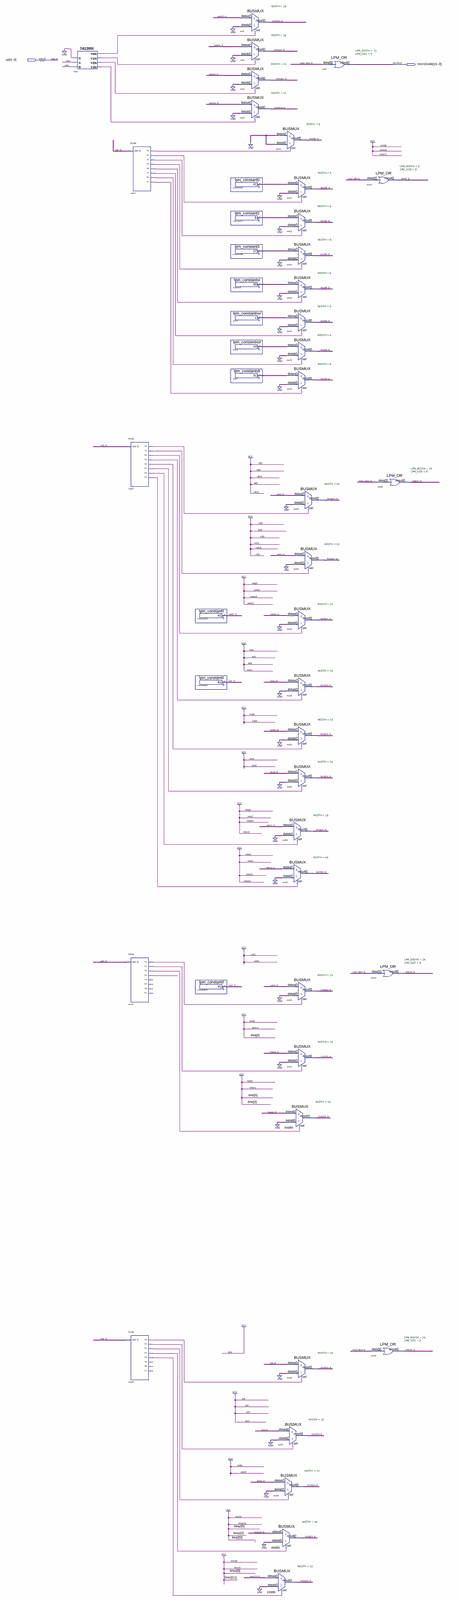
[diagram p0: schematic sheet, whole]
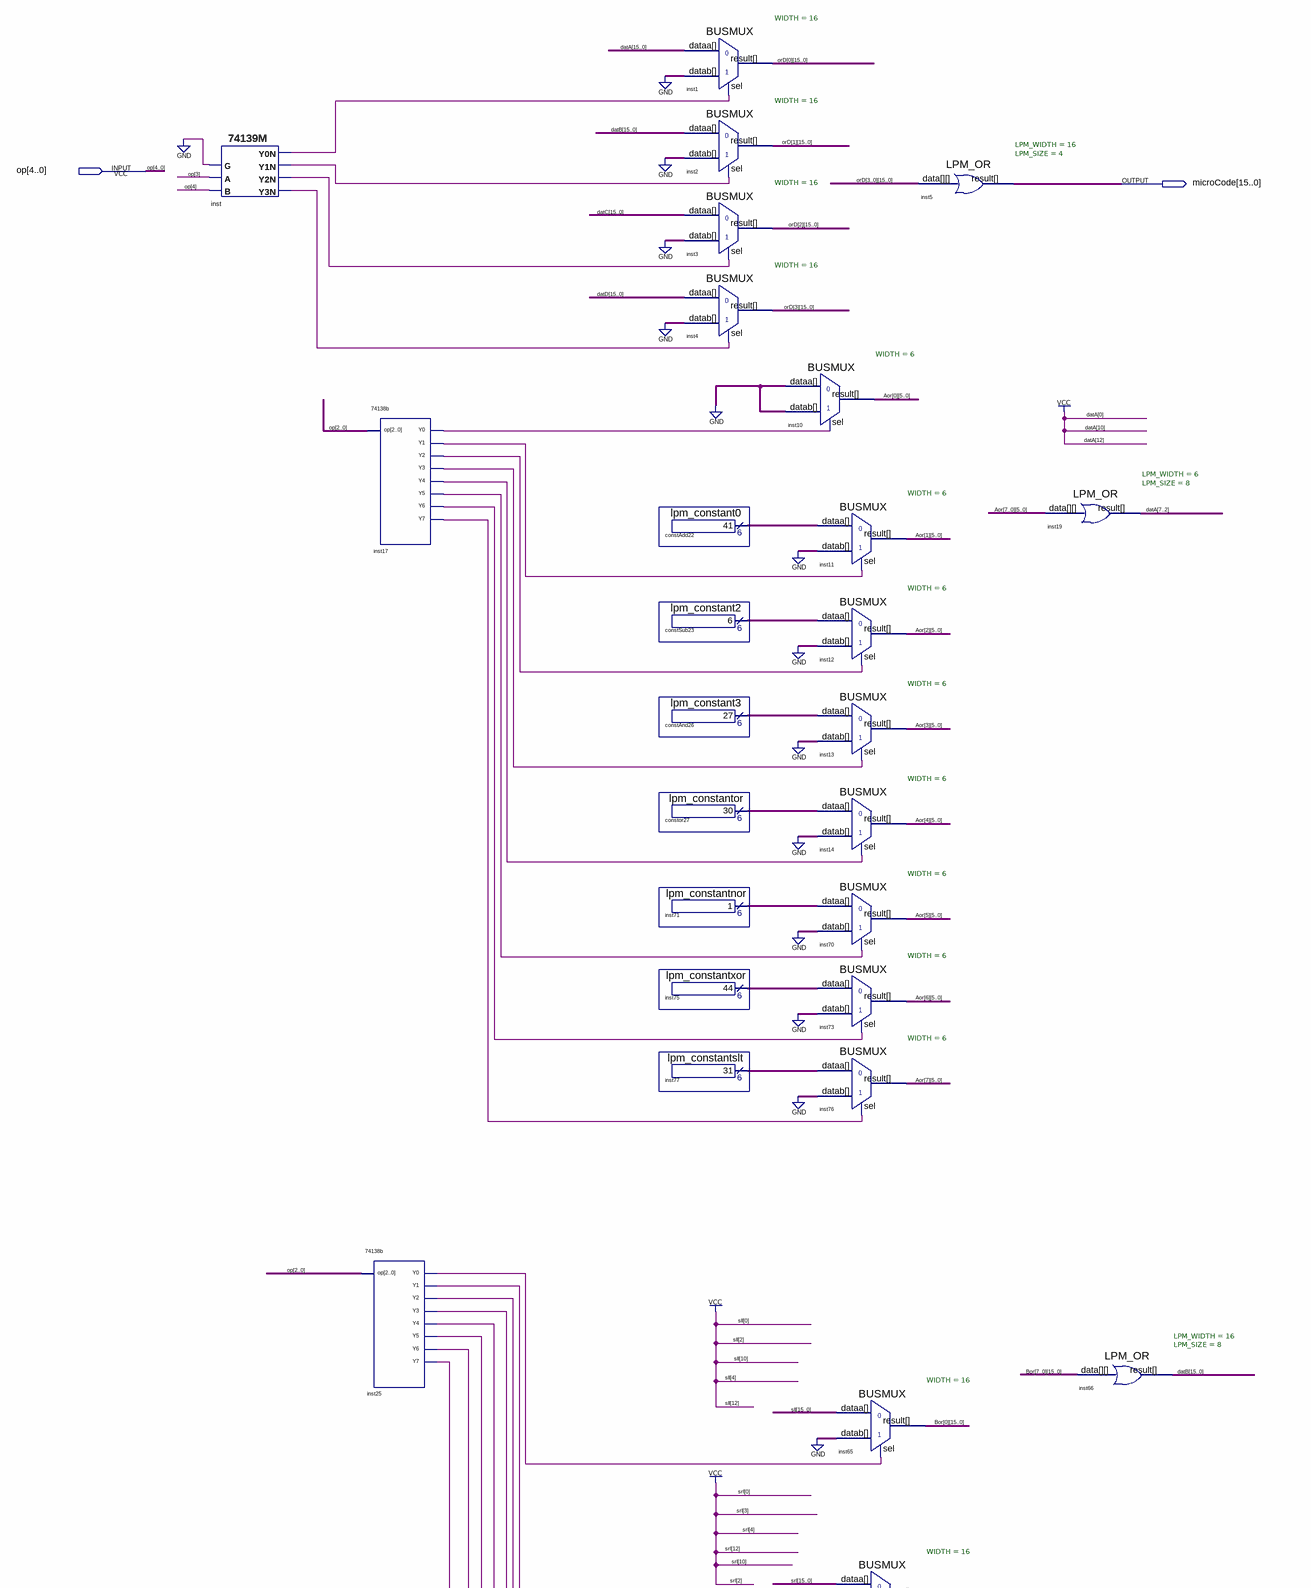
[diagram p1: schematic sheet, upper part]
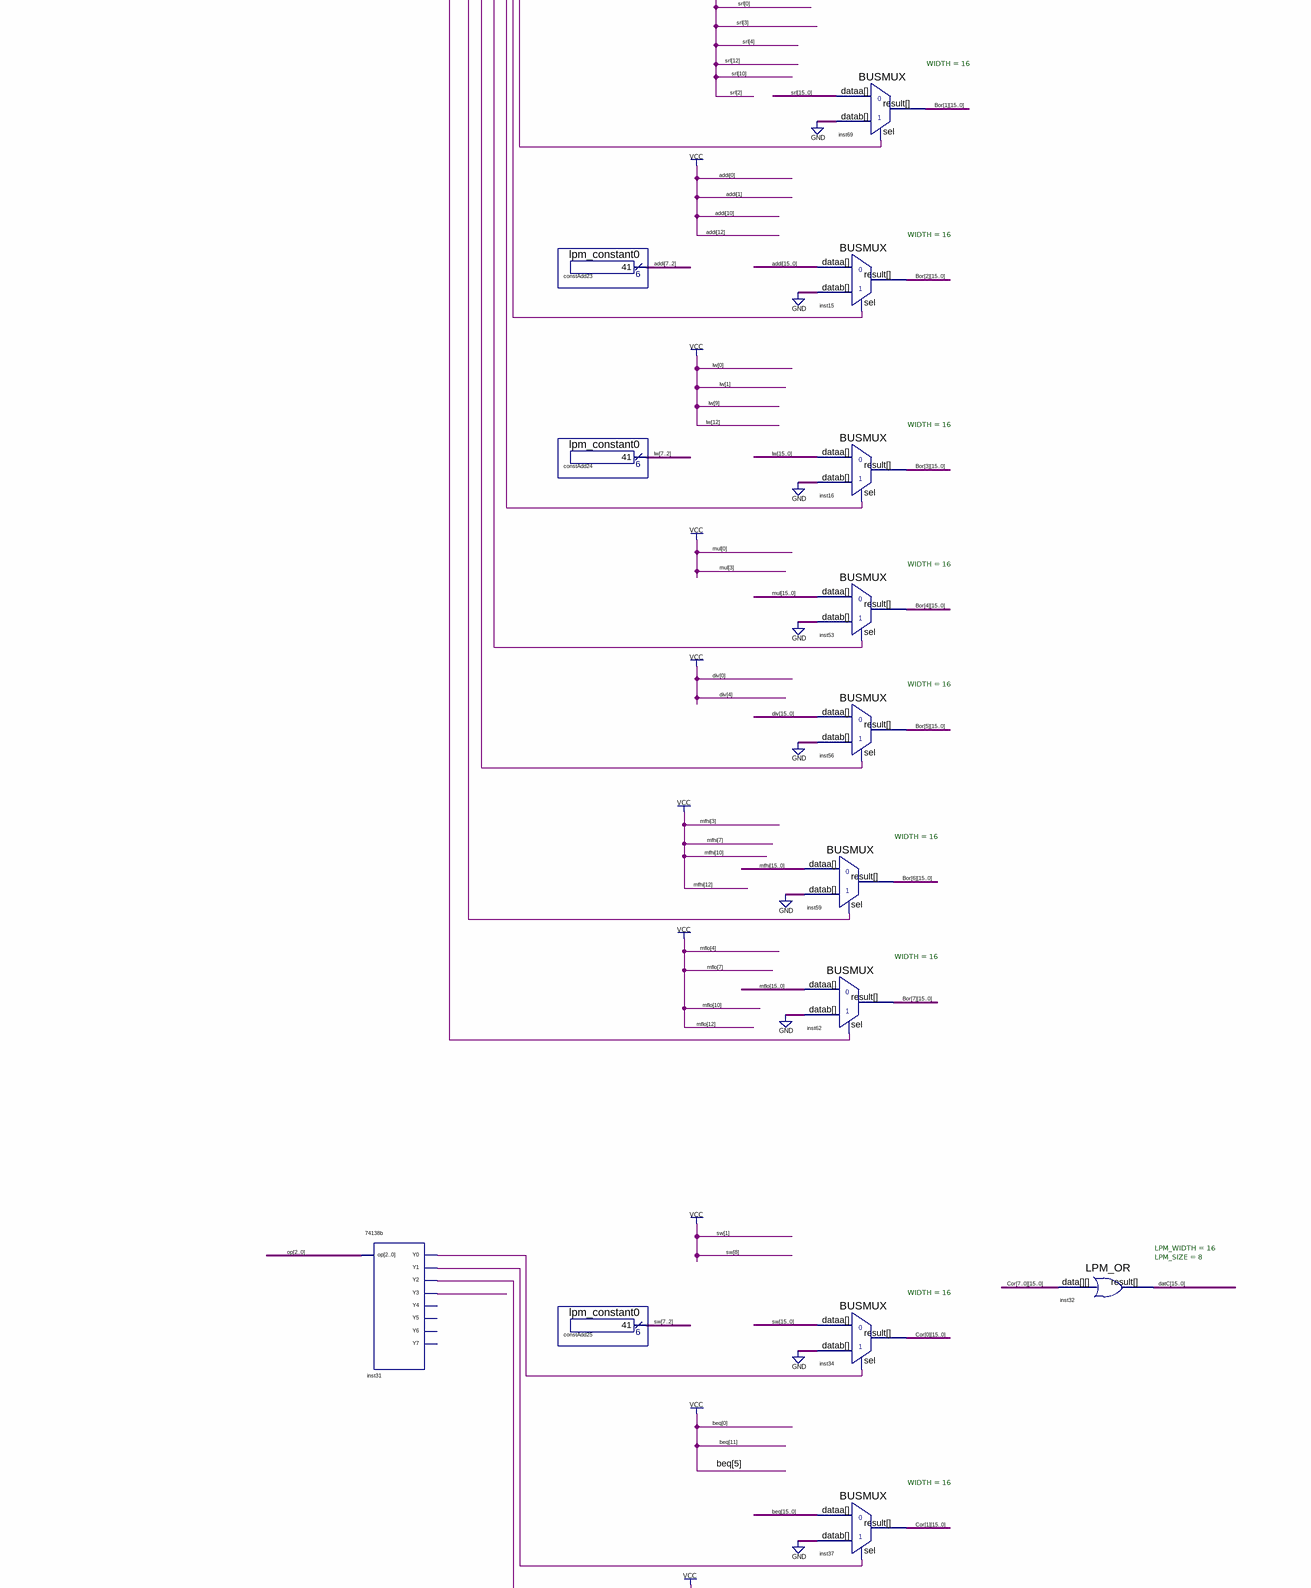
[diagram p2: schematic sheet, middle part]
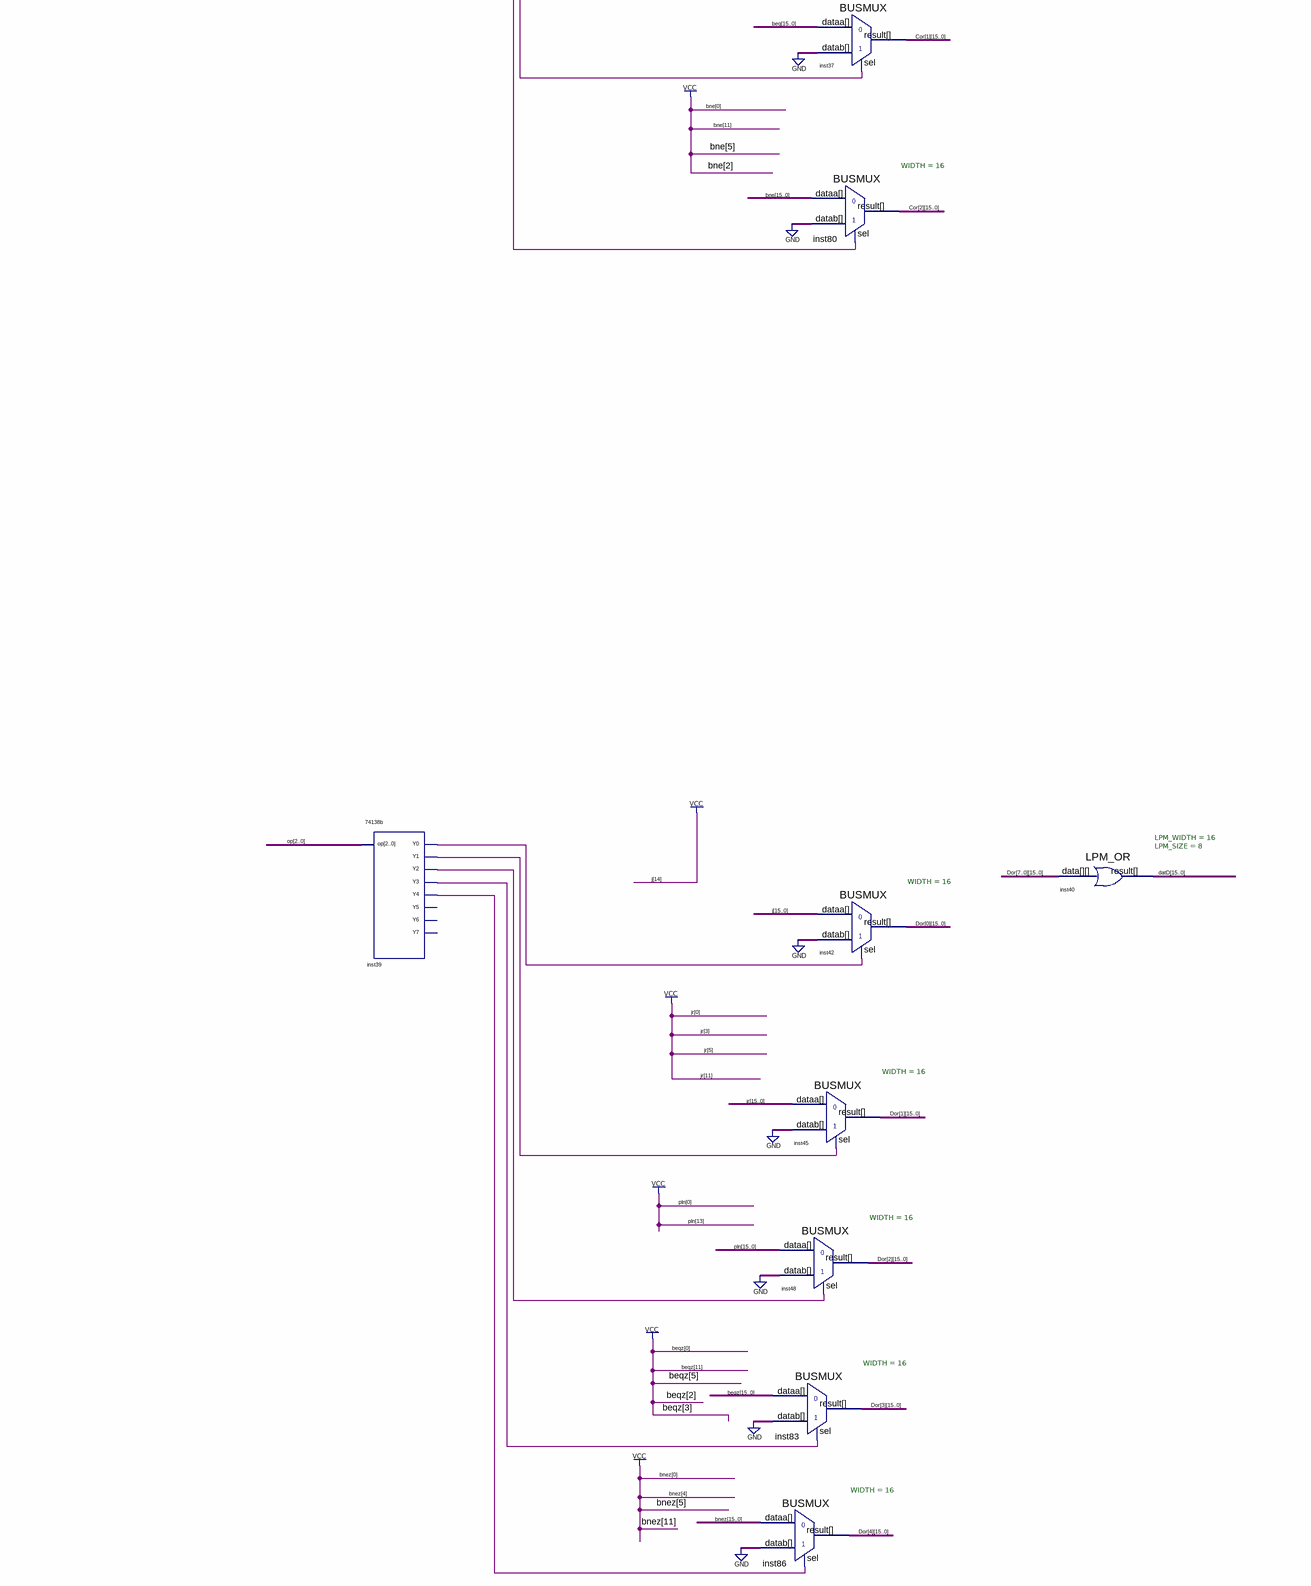
[diagram p3: schematic sheet, lower part]
// Quartus schematic hardCode.bdf as structural Verilog: 48 symbols, 2 pins
module hardCode (
  input  [4:0] op,
  output [15:0] microCode
);

  wire inst17_y0, inst17_y1, inst17_y2, inst17_y3, inst17_y4, inst17_y5, inst17_y6, inst17_y7, inst25_y0,
       inst25_y1, inst25_y2, inst25_y3, inst25_y4, inst25_y5, inst25_y6, inst25_y7, inst31_y0, inst31_y1,
       inst31_y2, inst31_y3, inst39_y0, inst39_y1, inst39_y2, inst39_y3, inst39_y4, inst_y0n, inst_y1n,
       inst_y2n, inst_y3n;
  wire [5:0] Aor_0, Aor_1, Aor_2, Aor_3, Aor_4, Aor_5, Aor_6, Aor_7, constAdd22_result, constAnd26_result,
       constor27_result, constSub23_result, inst71_result, inst75_result, inst77_result;
  wire [15:0] Bor_0, Bor_1, Bor_2, Bor_3, Bor_4, Bor_5, Bor_6, Bor_7, Cor_0, Cor_1, Cor_2, Cor_3, Cor_4,
       Cor_5, Cor_6, Cor_7, datB, datC, datD, Dor_0, Dor_1, Dor_2, Dor_3, Dor_4, Dor_5, Dor_6, Dor_7, j,
       mfhi, mflo, orD_0, orD_1, orD_2, orD_3, sw;
  wire [15:1] beq, beqz, bne, bnez, datA, div, jr, mul, pln, sll, srl;
  wire [15:2] addi, lw;

  \74139M  inst (.B(op[4]), .A(op[3]), .G(1'b0), .Y3N(inst_y3n), .Y2N(inst_y2n), .Y0N(inst_y0n), .Y1N(inst_y1n));
  \74138b  inst17 (
    .op(op[2:0]), .Y0(inst17_y0), .Y1(inst17_y1), .Y2(inst17_y2), .Y3(inst17_y3), .Y4(inst17_y4),
    .Y5(inst17_y5), .Y6(inst17_y6), .Y7(inst17_y7));
  \74138b  inst25 (
    .op(op[2:0]), .Y0(inst25_y0), .Y1(inst25_y1), .Y2(inst25_y2), .Y3(inst25_y3), .Y4(inst25_y4),
    .Y5(inst25_y5), .Y6(inst25_y6), .Y7(inst25_y7));
  \74138b  inst31 (
    .op(op[2:0]), .Y0(inst31_y0), .Y1(inst31_y1), .Y2(inst31_y2), .Y3(inst31_y3));  // open: Y4, Y5, Y6, Y7
  \74138b  inst39 (
    .op(op[2:0]), .Y0(inst39_y0), .Y1(inst39_y1), .Y2(inst39_y2), .Y3(inst39_y3), .Y4(inst39_y4));  // open: Y5, Y6, Y7
  lpm_constant0 constAdd23 (.result(addi[7:2]));
  lpm_constant0 constAdd24 (.result(lw[7:2]));
  lpm_constant0 constAdd25 (.result(sw[7:2]));
  BUSMUX #(.WIDTH(16)) inst1 (
    .datab({16{1'b0}}), .sel(inst_y0n), .dataa({datA[15:13], 1'b1, datA[11], 1'b1, datA[9:1], 1'b1}),
    .result(orD_0));
  BUSMUX #(.WIDTH(16)) inst2 (.datab({16{1'b0}}), .sel(inst_y1n), .dataa(datB), .result(orD_1));
  BUSMUX #(.WIDTH(16)) inst3 (.datab({16{1'b0}}), .sel(inst_y2n), .dataa(datC), .result(orD_2));
  BUSMUX #(.WIDTH(16)) inst4 (.datab({16{1'b0}}), .sel(inst_y3n), .dataa(datD), .result(orD_3));
  lpm_constant0 constAdd22 (.result(constAdd22_result));
  lpm_constant2 constSub23 (.result(constSub23_result));
  lpm_constant3 constAnd26 (.result(constAnd26_result));
  lpm_constantor constor27 (.result(constor27_result));
  lpm_constantnor inst71 (.result(inst71_result));
  lpm_constantxor inst75 (.result(inst75_result));
  lpm_constantslt inst77 (.result(inst77_result));
  BUSMUX #(.WIDTH(6)) inst10 (.datab({6{1'b0}}), .sel(inst17_y0), .dataa({6{1'b0}}), .result(Aor_0));
  BUSMUX #(.WIDTH(16)) inst48 (
    .datab({16{1'b0}}), .sel(inst39_y2), .dataa({pln[15:14], 1'b1, pln[12:1], 1'b1}), .result(Dor_2));
  BUSMUX #(.WIDTH(16)) inst83 (
    .datab({16{1'b0}}), .sel(inst39_y3),
    .dataa({beqz[15:12], 1'b1, beqz[10:6], 1'b1, beqz[4], 2'b11, beqz[1], 1'b1}), .result(Dor_3));
  BUSMUX #(.WIDTH(16)) inst86 (
    .datab({16{1'b0}}), .sel(inst39_y4), .dataa({bnez[15:12], 1'b1, bnez[10:6], 2'b11, bnez[3:1], 1'b1}),
    .result(Dor_4));
  BUSMUX #(.WIDTH(6)) inst11 (.datab({6{1'b0}}), .sel(inst17_y1), .dataa(constAdd22_result), .result(Aor_1));
  BUSMUX #(.WIDTH(6)) inst12 (.datab({6{1'b0}}), .sel(inst17_y2), .dataa(constSub23_result), .result(Aor_2));
  BUSMUX #(.WIDTH(6)) inst13 (.datab({6{1'b0}}), .sel(inst17_y3), .dataa(constAnd26_result), .result(Aor_3));
  BUSMUX #(.WIDTH(6)) inst14 (.datab({6{1'b0}}), .sel(inst17_y4), .dataa(constor27_result), .result(Aor_4));
  BUSMUX #(.WIDTH(6)) inst70 (.datab({6{1'b0}}), .sel(inst17_y5), .dataa(inst71_result), .result(Aor_5));
  BUSMUX #(.WIDTH(6)) inst73 (.datab({6{1'b0}}), .sel(inst17_y6), .dataa(inst75_result), .result(Aor_6));
  BUSMUX #(.WIDTH(6)) inst76 (.datab({6{1'b0}}), .sel(inst17_y7), .dataa(inst77_result), .result(Aor_7));
  BUSMUX #(.WIDTH(16)) inst65 (
    .datab({16{1'b0}}), .sel(inst25_y0),
    .dataa({sll[15:13], 1'b1, sll[11], 1'b1, sll[9:5], 1'b1, sll[3], 1'b1, sll[1], 1'b1}), .result(Bor_0));
  BUSMUX #(.WIDTH(16)) inst69 (
    .datab({16{1'b0}}), .sel(inst25_y1),
    .dataa({srl[15:13], 1'b1, srl[11], 1'b1, srl[9:5], 3'b111, srl[1], 1'b1}), .result(Bor_1));
  BUSMUX #(.WIDTH(16)) inst15 (
    .datab({16{1'b0}}), .sel(inst25_y2), .dataa({addi[15:13], 1'b1, addi[11], 1'b1, addi[9:2], 2'b11}),
    .result(Bor_2));
  BUSMUX #(.WIDTH(16)) inst16 (
    .datab({16{1'b0}}), .sel(inst25_y3), .dataa({lw[15:13], 1'b1, lw[11:10], 1'b1, lw[8:2], 2'b11}),
    .result(Bor_3));
  BUSMUX #(.WIDTH(16)) inst53 (
    .datab({16{1'b0}}), .sel(inst25_y4), .dataa({mul[15:4], 1'b1, mul[2:1], 1'b1}), .result(Bor_4));
  BUSMUX #(.WIDTH(16)) inst56 (
    .datab({16{1'b0}}), .sel(inst25_y5), .dataa({div[15:5], 1'b1, div[3:1], 1'b1}), .result(Bor_5));
  BUSMUX #(.WIDTH(16)) inst59 (
    .datab({16{1'b0}}), .sel(inst25_y6),
    .dataa({mfhi[15:13], 1'b1, mfhi[11], 1'b1, mfhi[9:8], 1'b1, mfhi[6:4], 1'b1, mfhi[2:0]}), .result(Bor_6));
  BUSMUX #(.WIDTH(16)) inst62 (
    .datab({16{1'b0}}), .sel(inst25_y7),
    .dataa({mflo[15:13], 1'b1, mflo[11], 1'b1, mflo[9:8], 1'b1, mflo[6:5], 1'b1, mflo[3:0]}), .result(Bor_7));
  BUSMUX #(.WIDTH(16)) inst34 (
    .datab({16{1'b0}}), .sel(inst31_y0), .dataa({sw[15:9], 1'b1, sw[7:2], 1'b1, sw[0]}), .result(Cor_0));
  BUSMUX #(.WIDTH(16)) inst37 (
    .datab({16{1'b0}}), .sel(inst31_y1), .dataa({beq[15:12], 1'b1, beq[10:6], 1'b1, beq[4:1], 1'b1}),
    .result(Cor_1));
  BUSMUX #(.WIDTH(16)) inst80 (
    .datab({16{1'b0}}), .sel(inst31_y2),
    .dataa({bne[15:12], 1'b1, bne[10:6], 1'b1, bne[4:3], 1'b1, bne[1], 1'b1}), .result(Cor_2));
  BUSMUX #(.WIDTH(16)) inst42 (.datab({16{1'b0}}), .sel(inst39_y0), .dataa({j[15], 1'b1, j[13:0]}), .result(Dor_0));
  BUSMUX #(.WIDTH(16)) inst45 (
    .datab({16{1'b0}}), .sel(inst39_y1),
    .dataa({jr[15:12], 1'b1, jr[10:6], 1'b1, jr[4], 1'b1, jr[2:1], 1'b1}), .result(Dor_1));
  LPM_OR #(.LPM_WIDTH(16), .LPM_SIZE(4)) inst5 (.data({orD_3, orD_2, orD_1, orD_0}), .result(microCode));
  LPM_OR #(.LPM_WIDTH(6), .LPM_SIZE(8)) inst19 (
    .data({Aor_7, Aor_6, Aor_5, Aor_4, Aor_3, Aor_2, Aor_1, Aor_0}), .result(datA[7:2]));
  LPM_OR #(.LPM_WIDTH(16), .LPM_SIZE(8)) inst66 (
    .data({Bor_7, Bor_6, Bor_5, Bor_4, Bor_3, Bor_2, Bor_1, Bor_0}), .result(datB));
  LPM_OR #(.LPM_WIDTH(16), .LPM_SIZE(8)) inst32 (
    .data({Cor_7, Cor_6, Cor_5, Cor_4, Cor_3, Cor_2, Cor_1, Cor_0}), .result(datC));
  LPM_OR #(.LPM_WIDTH(16), .LPM_SIZE(8)) inst40 (
    .data({Dor_7, Dor_6, Dor_5, Dor_4, Dor_3, Dor_2, Dor_1, Dor_0}), .result(datD));
endmodule
